# Altium schematic sheet Overview.SchDoc
size A4
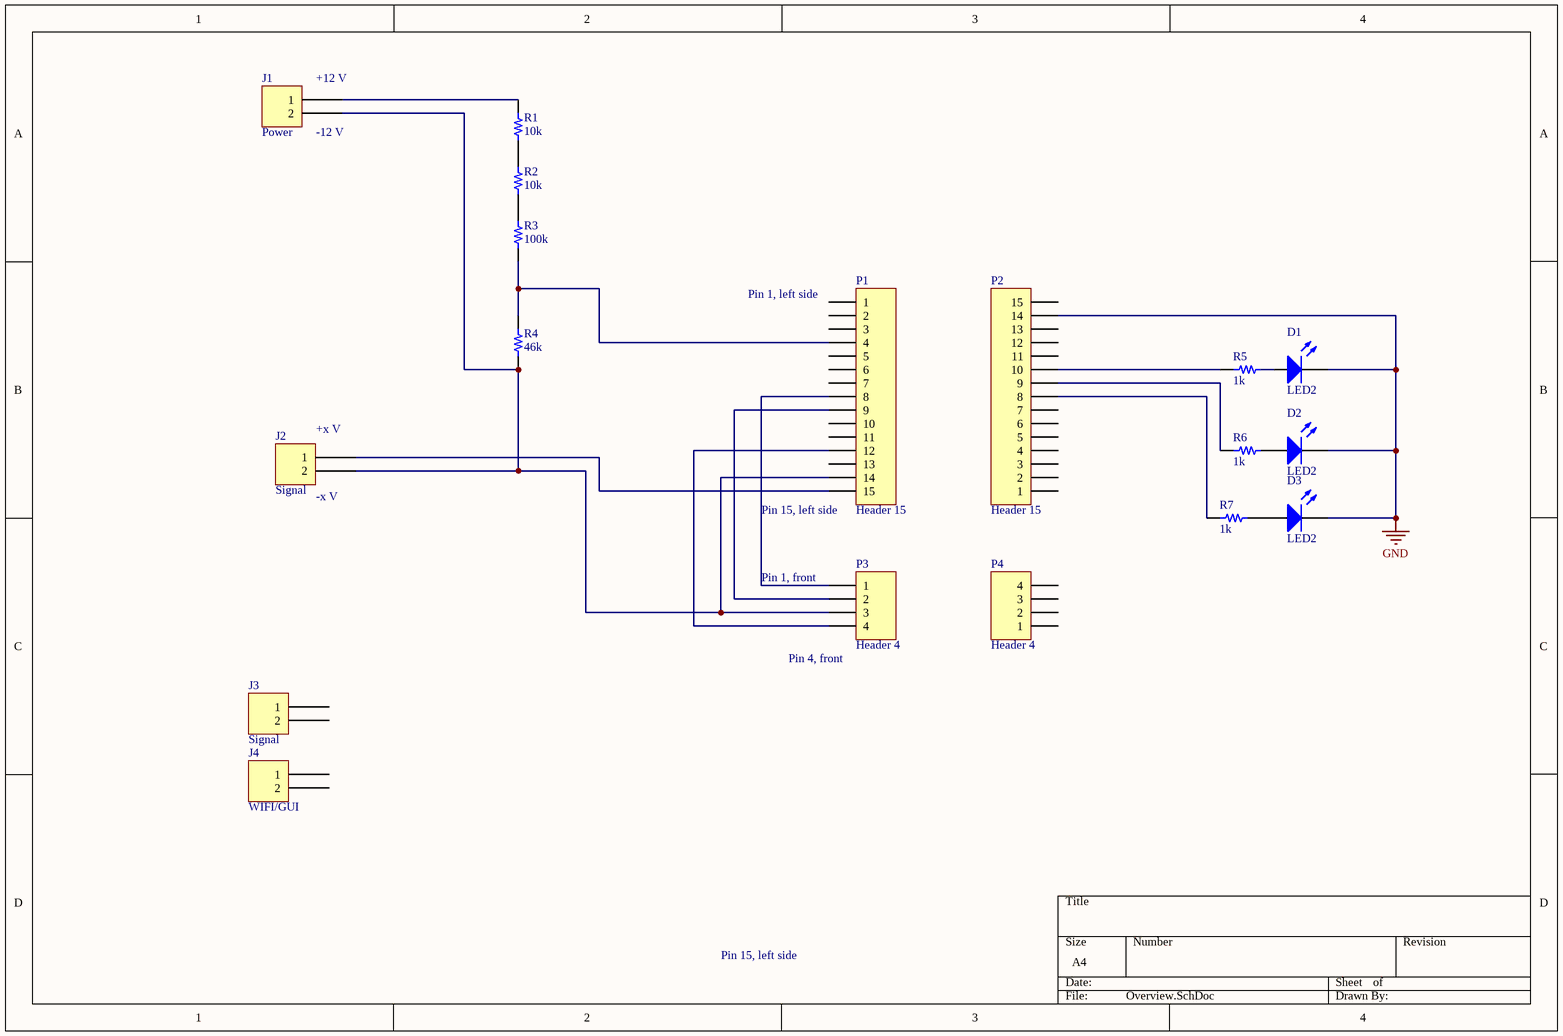
[diagram p0: Overview.SchDoc]

## Parts
D1  LED2  [3.2X1.6X1.1]
D2  LED2  [3.2X1.6X1.1]
D3  LED2  [3.2X1.6X1.1]
J1  Power  [JST XH B2B-XH-A]
J2  Signal  [JST XH B2B-XH-A]
J3  Signal  [JST XH B2B-XH-A]
J4  WIFI/GUI  [JST XH B2B-XH-A]
P1  Header 15  [HDR1X15]
P2  Header 15  [HDR1X15]
P3  Header 4  [HDR1X4]
P4  Header 4  [HDR1X4]
R1  10k  [RES 0805/2012]
R2  10k  [RES 0805/2012]
R3  100k  [RES 0805/2012]
R4  46k  [RES 0805/2012]
R5  1k  [RES 0805/2012]
R6  1k  [RES 0805/2012]
R7  1k  [RES 0805/2012]

## Nets
GND: D1.2(K) D2.2(K) D3.2(K) P2.14
NetD1_1: D1.1(A) R5.2
NetD3_1: D3.1(A) R7.2
NetJ1_1: J1.1 R1.2
NetJ1_2: J1.2 J2.2 P1.14 P3.3 R4.1
NetJ2_1: J2.1 P1.15
NetP1_4: P1.4 R3.1 R4.2
NetP1_8: P1.8 P3.1
NetP1_9: P1.9 P3.2
NetP1_12: P1.12 P3.4
NetP2_8: P2.8 R7.1
NetP2_9: P2.9 R6.1
NetP2_10: P2.10 R5.1
NetR1_1: R1.1 R2.2
NetR2_1: R2.1 R3.2

Not connected (* = marked no-connect by the designer): D2 1(A); J3 1 2; J4 1 2; P1 1 2 3 5 6 7 10 11 13; P2 1 2 3 4 5 6 7 11 12 13 15; P4 1 2 3 4; R6 2

## Notes on the sheet
- (near J1) +12 V
- (near J1) -12 V
- (near P1) Pin 1, left side
- (near J2) +x V
- (near J2) -x V
- (near P1) Pin 15, left side
- (near P3) Pin 1, front
- (near P3) Pin 4, front
- Pin 15, left side

## Library data of the parts
D1 = LED2: RED; Published: 8-Jun-2000; LatestRevisionDate: 17-Jul-2002; LatestRevisionNote: Re-released for DXP Platform.; PackageVersion: Feb-2002; PackageReference: 3.2X1.6X1.1; Publisher: Altium Limited; PackageDescription: SM LED; 2 Flat Leads
D2 = LED2: GREEN; Published: 8-Jun-2000; LatestRevisionDate: 17-Jul-2002; LatestRevisionNote: Re-released for DXP Platform.; PackageVersion: Feb-2002; PackageReference: 3.2X1.6X1.1; Publisher: Altium Limited; PackageDescription: SM LED; 2 Flat Leads
D3 = LED2: YELLOW; Published: 8-Jun-2000; LatestRevisionDate: 17-Jul-2002; LatestRevisionNote: Re-released for DXP Platform.; PackageVersion: Feb-2002; PackageReference: 3.2X1.6X1.1; Publisher: Altium Limited; PackageDescription: SM LED; 2 Flat Leads
J1-J4 = B2B-XH-A(LF)(SN): CONN HEADER XH TOP 2POS 2.5MM; Manufacturer: JST Sales America Inc.; Pitch: 0.098" (2.50mm); Number Of Positions: 2; Part Number: B2B-XH-A(LF)(SN); Colour: Natural; PartId: 16449; Supplier 1: Digi-Key; Supplier Part Number 1: 455-2247-ND; ComponentLink1Description: Datasheet; ComponentLink1URL: http://www.jst-mfg.com/product/pdf/eng/eXH.pdf; ComponentLink2Description: Digi-Key Listing; ComponentLink2URL: http://www.digikey.com/product-detail/en/jst-sales-america-inc/B2B-XH-A(LF)(SN)/455-2247-ND/1651045; Price: 0,15; Type: Header, Shrouded; Contact Finish: Tin; Fastening Type: Detent Lock; Number Of Rows: 1; Series: XH
P1 P2 = Header 15: Header, 15-Pin; LatestRevisionDate: 17-Jul-2002; LatestRevisionNote: Re-released for DXP Platform.; Publisher: Altium Limited
P3 P4 = Header 4: Header, 4-Pin; LatestRevisionDate: 17-Jul-2002; LatestRevisionNote: Re-released for DXP Platform.; Publisher: Altium Limited
R1-R7 = ERJ-6GEYJ104V: RES SMD 100K OHM 5% 1/8W 0805; Manufacturer: Panasonic Electronic Components; TemperatureRange: -55C ~ 155C; TemperatureCoefficient: 200ppm/C; PowerRating: 0.125W, 1/8W; Value: 100k; Part Number: ERJ-6GEYJ104V; PartId: 11445; Supplier 1: Digi-Key; Supplier Part Number 1: P100KATR-ND; ComponentLink1Description: Datasheet; ComponentLink1URL: http://industrial.panasonic.com/www-cgi/jvcr13pz.cgi?E+PZ+3+AOA0001+ERJ6GEYJ104V+7+WW; ComponentLink2Description: Digi-Key Listing; ComponentLink2URL: https://www.digikey.com/product-detail/en/panasonic-electronic-components/ERJ-6GEYJ104V/P100KATR-ND/83110; Tolerance: 5%; Price: 0,0032; Device Package: 0805 (2012 Metric)